# Altium schematic sheet PiModulos - Rams Head.SchDoc
size B
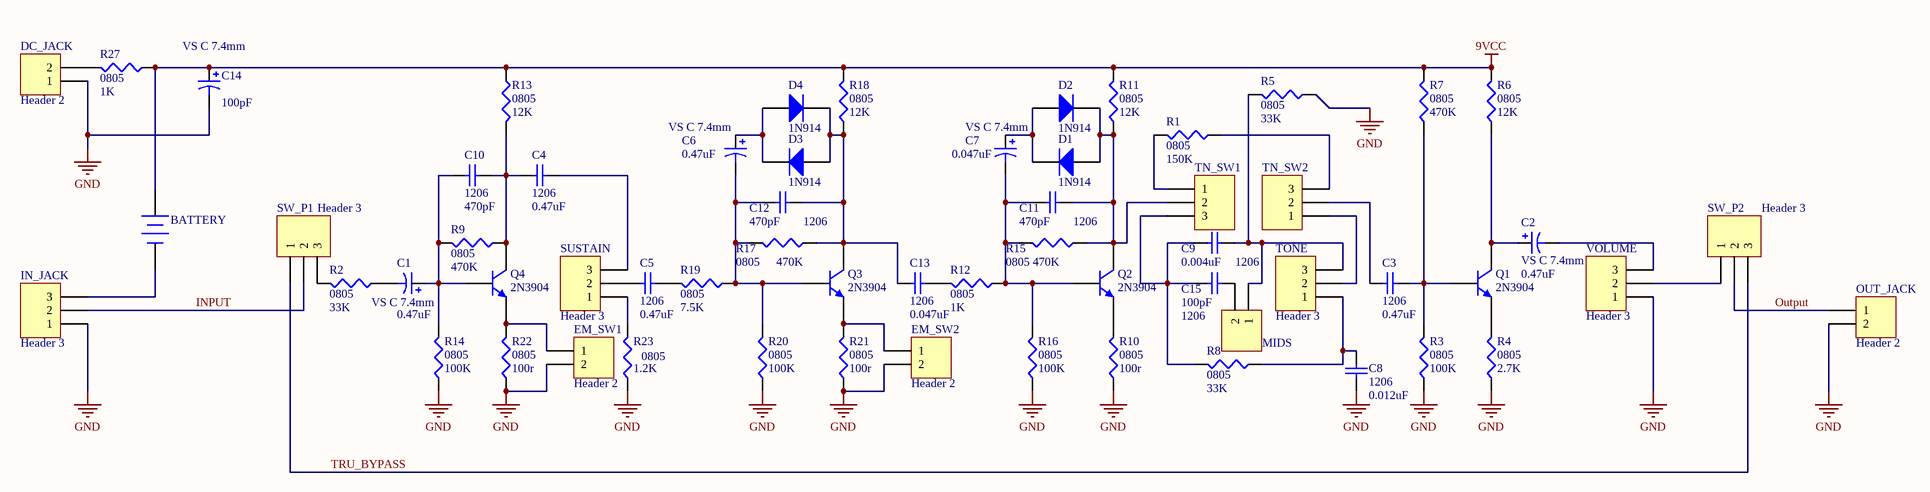
[diagram p0: PiModulos - Rams Head.SchDoc]

## Parts
BATTERY  Battery  [BAT-2]  (value not drawn)
C1  VS C 7.4mm  value 0.47uF  [Panasonic VS C]
C2  VS C 7.4mm  value 0.47uF  [Panasonic VS C]
C3  1206  value 0.47uF  [C1206]
C4  1206  value 0.47uF  [C1206]
C5  1206  value 0.47uF  [C1206]
C6  VS C 7.4mm  value 0.47uF  [Panasonic VS C]
C7  VS C 7.4mm  value 0.047uF  [Panasonic VS C]
C8  1206  value 0.012uF  [C1206]
C9  1206  value 0.004uF  [C1206]
C10  1206  value 470pF  [C1206]
C11  1206  value 470pF  [C1206]
C12  1206  value 470pF  [C1206]
C13  1206  value 0.047uF  [C1206]
C14  VS C 7.4mm  value 100pF  [Panasonic VS C]
C15  1206  value 100pF  [C1206]
D1  1N914  [DO-35]
D2  1N914  [DO-35]
D3  1N914  [DO-35]
D4  1N914  [DO-35]
DC_JACK  Header 2  [HDR1X2]
EM_SW1  Header 2  [HDR1X2]
EM_SW2  Header 2  [HDR1X2]
IN_JACK  Header 3  [HDR1X3]
MIDS  Header 2  [HDR1X2]  (value not drawn)
OUT_JACK  Header 2  [HDR1X2]
Q1  2N3904  [TO-92A]
Q2  2N3904  [TO-92A]
Q3  2N3904  [TO-92A]
Q4  2N3904  [TO-92A]
R1  0805  value 150K  [SM 0805 - gap trimmed]
R2  0805  value 33K  [SM 0805 - gap trimmed]
R3  0805  value 100K  [SM 0805 - gap trimmed]
R4  0805  value 2.7K  [SM 0805 - gap trimmed]
R5  0805  value 33K  [SM 0805 - gap trimmed]
R6  0805  value 12K  [SM 0805 - gap trimmed]
R7  0805  value 470K  [SM 0805 - gap trimmed]
R8  0805  value 33K  [SM 0805 - gap trimmed]
R9  0805  value 470K  [SM 0805 - gap trimmed]
R10  0805  value 100r  [SM 0805 - gap trimmed]
R11  0805  value 12K  [SM 0805 - gap trimmed]
R12  0805  value 1K  [SM 0805 - gap trimmed]
R13  0805  value 12K  [SM 0805 - gap trimmed]
R14  0805  value 100K  [SM 0805 - gap trimmed]
R15  0805  value 470K  [SM 0805 - gap trimmed]
R16  0805  value 100K  [SM 0805 - gap trimmed]
R17  0805  value 470K  [SM 0805 - gap trimmed]
R18  0805  value 12K  [SM 0805 - gap trimmed]
R19  0805  value 7.5K  [SM 0805 - gap trimmed]
R20  0805  value 100K  [SM 0805 - gap trimmed]
R21  0805  value 100r  [SM 0805 - gap trimmed]
R22  0805  value 100r  [SM 0805 - gap trimmed]
R23  0805  value 1.2K  [SM 0805 - gap trimmed]
R27  0805  value 1K  [SM 0805 - gap trimmed]
SUSTAIN  Header 3  [HDR1X3]
SW_P1  Header 3  [HDR1X3]
SW_P2  Header 3  [HDR1X3]
TN_SW1  Header 3  [HDR1X3]  (value not drawn)
TN_SW2  Header 3  [HDR1X3]  (value not drawn)
TONE  Header 3  [HDR1X3]
VOLUME  Header 3  [HDR1X3]

## Nets
9VCC: BATTERY.1(+) C14.1 R6.2 R7.2 R11.2 R13.1 R18.2 R27.1
GND: C8.1 C14.2 DC_JACK.1 EM_SW1.2 EM_SW2.2 IN_JACK.1 OUT_JACK.2 R3.1 R4.1 R5.1 R10.1 R14.1 R16.1 R20.1 R21.1 R22.1 R23.1 VOLUME.1
INPUT: IN_JACK.2 SW_P1.2
Output: OUT_JACK.1 SW_P2.2
TRU_BYPASS: SW_P1.1 SW_P2.3
NetBATTERY_2: BATTERY.2(-) IN_JACK.3
NetC1_1: C1.1 C10.1 Q4.2(B) R9.2 R14.2
NetC1_2: C1.2 R2.1
NetC2_1: C2.1 Q1.3(C) R6.1
NetC2_2: C2.2 VOLUME.3
NetC3_1: C3.1 TN_SW2.2
NetC3_2: C3.2 Q1.2(B) R3.2 R7.1
NetC4_1: C4.1 C10.2 Q4.3(C) R9.1 R13.2
NetC4_2: C4.2 SUSTAIN.3
NetC5_1: C5.1 SUSTAIN.2
NetC5_2: C5.2 R19.2
NetC6_1: C6.1 D3.2(K) D4.1(A)
NetC6_2: C6.2 C12.1 Q3.2(B) R17.2 R19.1 R20.2
NetC7_1: C7.1 D1.2(K) D2.1(A)
NetC7_2: C7.2 C11.1 Q2.2(B) R12.1 R15.2 R16.2
NetC8_2: C8.2 R8.1 TONE.1
NetC9_1: C9.1 C15.1 R8.2 TN_SW1.3
NetC9_2: C9.2 MIDS.1 R5.2 TONE.3
NetC11_2: C11.2 D1.1(A) D2.2(K) Q2.3(C) R11.1 R15.1 TN_SW1.2
NetC12_2: C12.2 C13.1 D3.1(A) D4.2(K) Q3.3(C) R17.1 R18.1
NetC13_2: C13.2 R12.2
NetC15_2: C15.2 MIDS.2
NetDC_JACK_2: DC_JACK.2 R27.2
NetEM_SW1_1: EM_SW1.1 Q4.1(E) R22.2
NetEM_SW2_1: EM_SW2.1 Q3.1(E) R21.2
NetQ1_1: Q1.1(E) R4.2
NetQ2_1: Q2.1(E) R10.2
NetR1_1: R1.1 TN_SW2.3
NetR1_2: R1.2 TN_SW1.1
NetR2_2: R2.2 SW_P1.3
NetR23_2: R23.2 SUSTAIN.1
NetSW_P2_1: SW_P2.1 VOLUME.2
NetTN_SW2_1: TN_SW2.1 TONE.2

## Library data of the parts
BATTERY = Battery: Multicell Battery; Published: 24-Mar-1999; LatestRevisionDate: 17-Jul-2002; LatestRevisionNote: Re-released for DXP Platform.; PackageReference: BAT-2; Publisher: Altium Limited; PackageDescription: Battery; 2 Leads
C1 C2 C6 C7 C14 = Cap Pol1: Polarized Capacitor (Radial); Published: 8-Jun-2000; LatestRevisionDate: 17-Jul-2002; LatestRevisionNote: Re-released for DXP Platform.; PackageReference: RB7.6-15; Publisher: Altium Limited; PackageDescription: Polarized Capacitor (Radial); 2 Leads
C3-C5 C8-C13 C15 = Cap Semi: Capacitor (Semiconductor SIM Model); Published: 8-Jun-2000; LatestRevisionDate: 29-May-2009; LatestRevisionNote: IPC-7351 Footprint Added.; PackageReference: C1206; Publisher: Altium Limited; PackageDescription: Chip Capacitor
D1-D4 = Diode 1N914: High Conductance Fast Diode; Published: 8-Jun-2000; LatestRevisionDate: 17-Jul-2002; LatestRevisionNote: Re-released for DXP Platform.; DatasheetVersion: 1997; PackageReference: DO-35; Publisher: Altium Limited; PackageDescription: Diode, Axial; Body 3.8 x 1.9 mm (LxDia. max), Lead Dia. 0.53 mm (max); Code_JEDEC: DO-204-AH; ComponentLink1Description: Manufacturer Link; ComponentLink1URL: http://www.fairchildsemi.com/; ComponentLink2Description: Datasheet; ComponentLink2URL: http://www.fairchildsemi.com/ds/1N%2F1N4448.pdf
DC_JACK EM_SW1 EM_SW2 MIDS OUT_JACK = Header 2: Header, 2-Pin; LatestRevisionDate: 17-Jul-2002; LatestRevisionNote: Re-released for DXP Platform.; Publisher: Altium Limited
IN_JACK SUSTAIN SW_P1 SW_P2 TN_SW1 TN_SW2 TONE VOLUME = Header 3: Header, 3-Pin; LatestRevisionDate: 17-Jul-2002; LatestRevisionNote: Re-released for DXP Platform.; Publisher: Altium Limited
Q1-Q4 = 2N3904: NPN General Purpose Amplifier; Published: 8-Jun-2000; LatestRevisionDate: 15-Jan-2003; LatestRevisionNote: PCB Footprint 'BCY-W3/D4.7' replaced; DatasheetVersion: 1997; PackageVersion: Sep-1998; PackageReference: TO-92A; Publisher: Altium Limited; PackageDescription: TO, Flat Index; 3 In-Line, Axial Leads; Body Dia. 4.5mm; Leads 0.51 x 0.48 mm (max); ComponentLink1Description: Manufacturer Link; ComponentLink1URL: http://www.fairchildsemi.com/; ComponentLink2Description: Datasheet; ComponentLink2URL: http://www.fairchildsemi.com/ds/2N%2F2N3904.pdf
R1-R23 R27 = Res3: Resistor; Published: 8-Jun-2000; LatestRevisionDate: 29-May-2009; LatestRevisionNote: IPC-7351 Footprint Added.; PackageReference: J1-0603; Publisher: Altium Limited; PackageDescription: Chip Resistor